# EAGLE schematic BigBirdTransmitter (EAGLE 9.3.0)
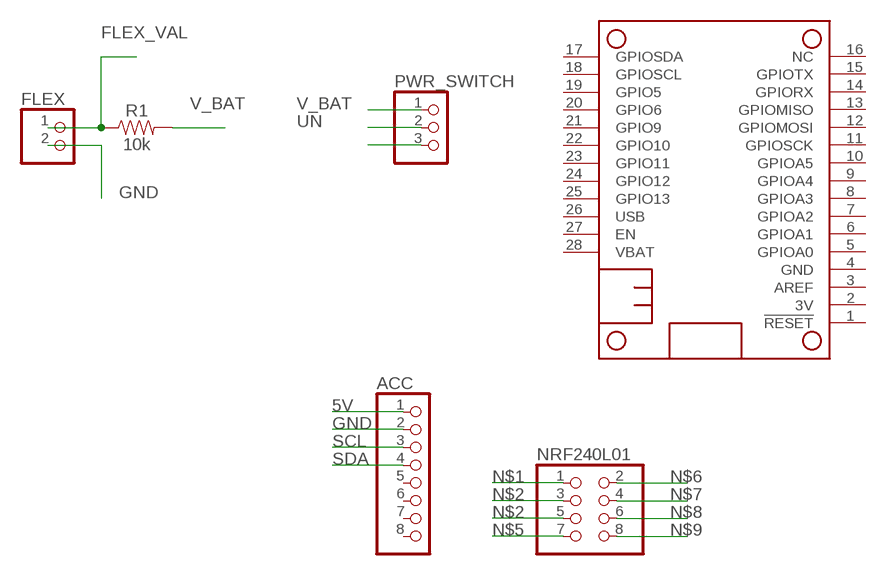
[diagram p0: schematic, sheet 1]

## Parts
ACC  PINHD-1X8BIG  [1X08-BIG]
FLEX  PINHD-1X2  [1X02]
MS1  FEATHERWING  [FEATHERWING]
NRF240L01  PINHD-2X4  [2X04]
PWR_SWITCH  PINHD-1X3  [1X03]
R1  10k  10KOHM-0402-1/16W-1%  [0402]

## Nets
5V: ACC.1
FLEX_VAL: FLEX.1 R1.1
GND: ACC.2 FLEX.2
N$1: NRF240L01.1
N$2: NRF240L01.3
N$3: PWR_SWITCH.3
N$4: NRF240L01.5
N$5: NRF240L01.7
N$6: NRF240L01.2
N$7: NRF240L01.4
N$8: NRF240L01.6
N$9: NRF240L01.8
SCL: ACC.3
SDA: ACC.4
UN: PWR_SWITCH.2
V_BAT: PWR_SWITCH.1 R1.2
Unconnected: ACC.5 ACC.6 ACC.7 ACC.8 MS1.1(!RESET) MS1.2(3V) MS1.3(AREF) MS1.5(GPIOA0) MS1.6(GPIOA1) MS1.7(GPIOA2) MS1.8(GPIOA3) MS1.9(GPIOA4) MS1.10(GPIOA5) MS1.11(GPIOSCK) MS1.12(GPIOMOSI) MS1.13(GPIOMISO) MS1.14(GPIORX) MS1.15(GPIOTX) MS1.16(NC) MS1.17(GPIOSDA) MS1.18(GPIOSCL) MS1.19(GPIO5) MS1.20(GPIO6) MS1.21(GPIO9) MS1.22(GPIO10) MS1.23(GPIO11) MS1.24(GPIO12) MS1.25(GPIO13) MS1.26(USB) MS1.27(EN) MS1.28(VBAT)

## Power pins joined to a net without a drawn wire
GND: MS1.4(GND)

## Library data of the parts
ACC = adafruit:PINHD-1X8: PIN HEADER
FLEX = pinhead:PINHD-1X2: PIN HEADER
MS1 = adafruitEDIT:FEATHERWING
NRF240L01 = pinhead:PINHD-2X4: PIN HEADER
PWR_SWITCH = pinhead:PINHD-1X3: PIN HEADER
R1 = SparkFun-Resistors:10KOHM: 10kΩ resistor A resistor is a passive two-terminal electrical component that implements electrical resistance as a circuit element. Resistors act to reduce current flow, and, at the same time, act to lower voltage levels within circuits. - Wikipedia; PROD_ID: RES-14241